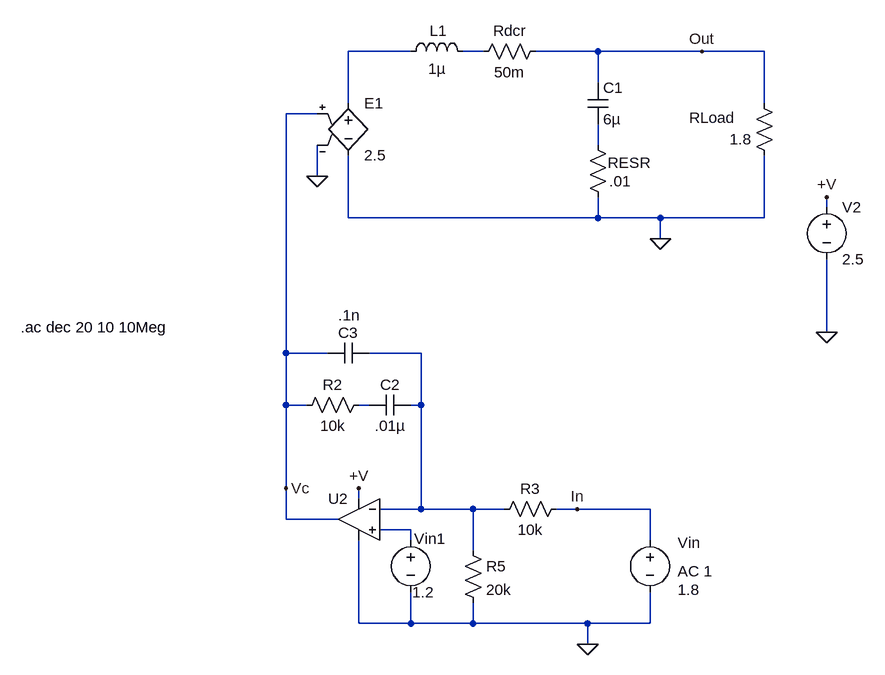
[diagram p0: schematic Lec18_Buck_AC.asc]
Lec18_Buck_AC.asc, the LTspice schematic file:
Version 4
SHEET 1 1344 1956
WIRE 640 -224 544 -224
WIRE 752 -224 720 -224
WIRE 928 -224 832 -224
WIRE 1088 -224 928 -224
WIRE 1184 -224 1088 -224
WIRE 928 -176 928 -224
WIRE 544 -144 544 -224
WIRE 1184 -144 1184 -224
WIRE 496 -128 448 -128
WIRE 928 -80 928 -112
WIRE 496 -32 496 -80
WIRE 1280 16 1280 0
WIRE 544 32 544 -64
WIRE 928 32 928 0
WIRE 928 32 544 32
WIRE 1024 32 928 32
WIRE 1184 32 1184 -64
WIRE 1184 32 1024 32
WIRE 1024 64 1024 32
WIRE 1280 208 1280 96
WIRE 448 240 448 -128
WIRE 512 240 448 240
WIRE 656 240 576 240
WIRE 448 320 448 240
WIRE 480 320 448 320
WIRE 576 320 560 320
WIRE 656 320 656 240
WIRE 656 320 640 320
WIRE 448 448 448 320
WIRE 560 464 560 448
WIRE 656 480 656 320
WIRE 656 480 592 480
WIRE 736 480 656 480
WIRE 784 480 736 480
WIRE 896 480 864 480
WIRE 1008 480 896 480
WIRE 448 496 448 448
WIRE 528 496 448 496
WIRE 640 512 592 512
WIRE 640 528 640 512
WIRE 1008 528 1008 480
WIRE 736 544 736 480
WIRE 560 656 560 528
WIRE 640 656 640 608
WIRE 640 656 560 656
WIRE 736 656 736 624
WIRE 736 656 640 656
WIRE 912 656 736 656
WIRE 1008 656 1008 608
WIRE 1008 656 912 656
WIRE 912 688 912 656
FLAG 1280 208 0
FLAG 912 688 0
FLAG 1280 0 +V
FLAG 560 448 +V
FLAG 1088 -224 Out
FLAG 896 480 In
FLAG 448 448 Vc
FLAG 1024 64 0
FLAG 496 -32 0
SYMBOL voltage 1280 0 R0
WINDOW 123 0 0 Left 2
WINDOW 39 0 0 Left 2
SYMATTR InstName V2
SYMATTR Value 2.5
SYMBOL ind 624 -208 R270
WINDOW 0 32 59 VTop 2
WINDOW 3 5 56 VBottom 2
SYMATTR InstName L1
SYMATTR Value 1µ
SYMBOL cap 912 -176 R0
SYMATTR InstName C1
SYMATTR Value 6µ
SYMBOL res 1168 -160 R0
WINDOW 0 -100 38 Left 2
WINDOW 3 -37 71 Left 2
SYMATTR InstName RLoad
SYMATTR Value 1.8
SYMBOL res 576 304 R90
WINDOW 0 0 56 VBottom 2
WINDOW 3 32 56 VTop 2
SYMATTR InstName R2
SYMATTR Value 10k
SYMBOL res 880 464 R90
WINDOW 0 0 56 VBottom 2
WINDOW 3 32 56 VTop 2
SYMATTR InstName R3
SYMATTR Value 10k
SYMBOL cap 640 304 R90
WINDOW 0 0 32 VBottom 2
WINDOW 3 32 32 VTop 2
SYMATTR InstName C2
SYMATTR Value .01µ
SYMBOL res 912 -96 R0
WINDOW 0 31 43 Left 2
WINDOW 3 33 72 Left 2
SYMATTR InstName RESR
SYMATTR Value .01
SYMBOL res 848 -240 R90
WINDOW 0 0 56 VBottom 2
WINDOW 3 32 56 VTop 2
SYMATTR InstName Rdcr
SYMATTR Value 50m
SYMBOL voltage 1008 512 R0
WINDOW 0 43 20 Left 2
WINDOW 123 43 64 Left 2
WINDOW 39 0 0 Left 2
WINDOW 3 43 92 Left 2
SYMATTR InstName Vin
SYMATTR Value2 AC 1
SYMATTR Value 1.8
SYMBOL e 544 -160 R0
SYMATTR InstName E1
SYMATTR Value 2.5
SYMBOL res 720 528 R0
SYMATTR InstName R5
SYMATTR Value 20k
SYMBOL cap 576 224 R90
WINDOW 0 0 32 VBottom 2
WINDOW 3 -58 31 VTop 2
SYMATTR InstName C3
SYMATTR Value .1n
SYMBOL voltage 640 512 R0
WINDOW 0 5 14 Left 2
WINDOW 39 0 0 Left 2
WINDOW 3 2 96 Left 2
SYMATTR InstName Vin1
SYMATTR Value 1.2
SYMATTR Value2 AC 0
SYMBOL OpAmps\\UniversalOpAmp2 560 496 M0
SYMATTR InstName U2
SYMATTR Value2 Avol=1Meg GBW=1G Slew=1G
TEXT 40 200 Left 2 !.ac dec 20 10 10Meg

The netlist it stands for:
* Lec18_Buck_AC.asc
V2 +V 0 2.5
L1 N001 N002 1µ
C1 Out N003 6µ
RLoad Out 0 1.8
R2 N005 Vc 10k
R3 In N004 10k
C2 N004 N005 .01µ
RESR N003 0 .01
Rdcr Out N002 50m
Vin In 0 1.8 AC 1
E1 N001 0 Vc 0 2.5
R5 N004 0 20k
C3 N004 Vc .1n
Vin1 N006 0 1.2 AC 0
XU2 N006 N004 +V 0 Vc level2 Avol=1Meg GBW=1G Slew=1G Ilimit=25m Rail=0 Vos=0 En=0 Enk=0 In=0 Ink=0 Rin=500Meg  ; pins In+ In- V+ V- OUT
.ac dec 20 10 10Meg
.lib UniversalOpAmp2.lib
.backanno
.end